# EAGLE design Adafruit GPS Logger Shield Rev D (EAGLE 9.6.2)
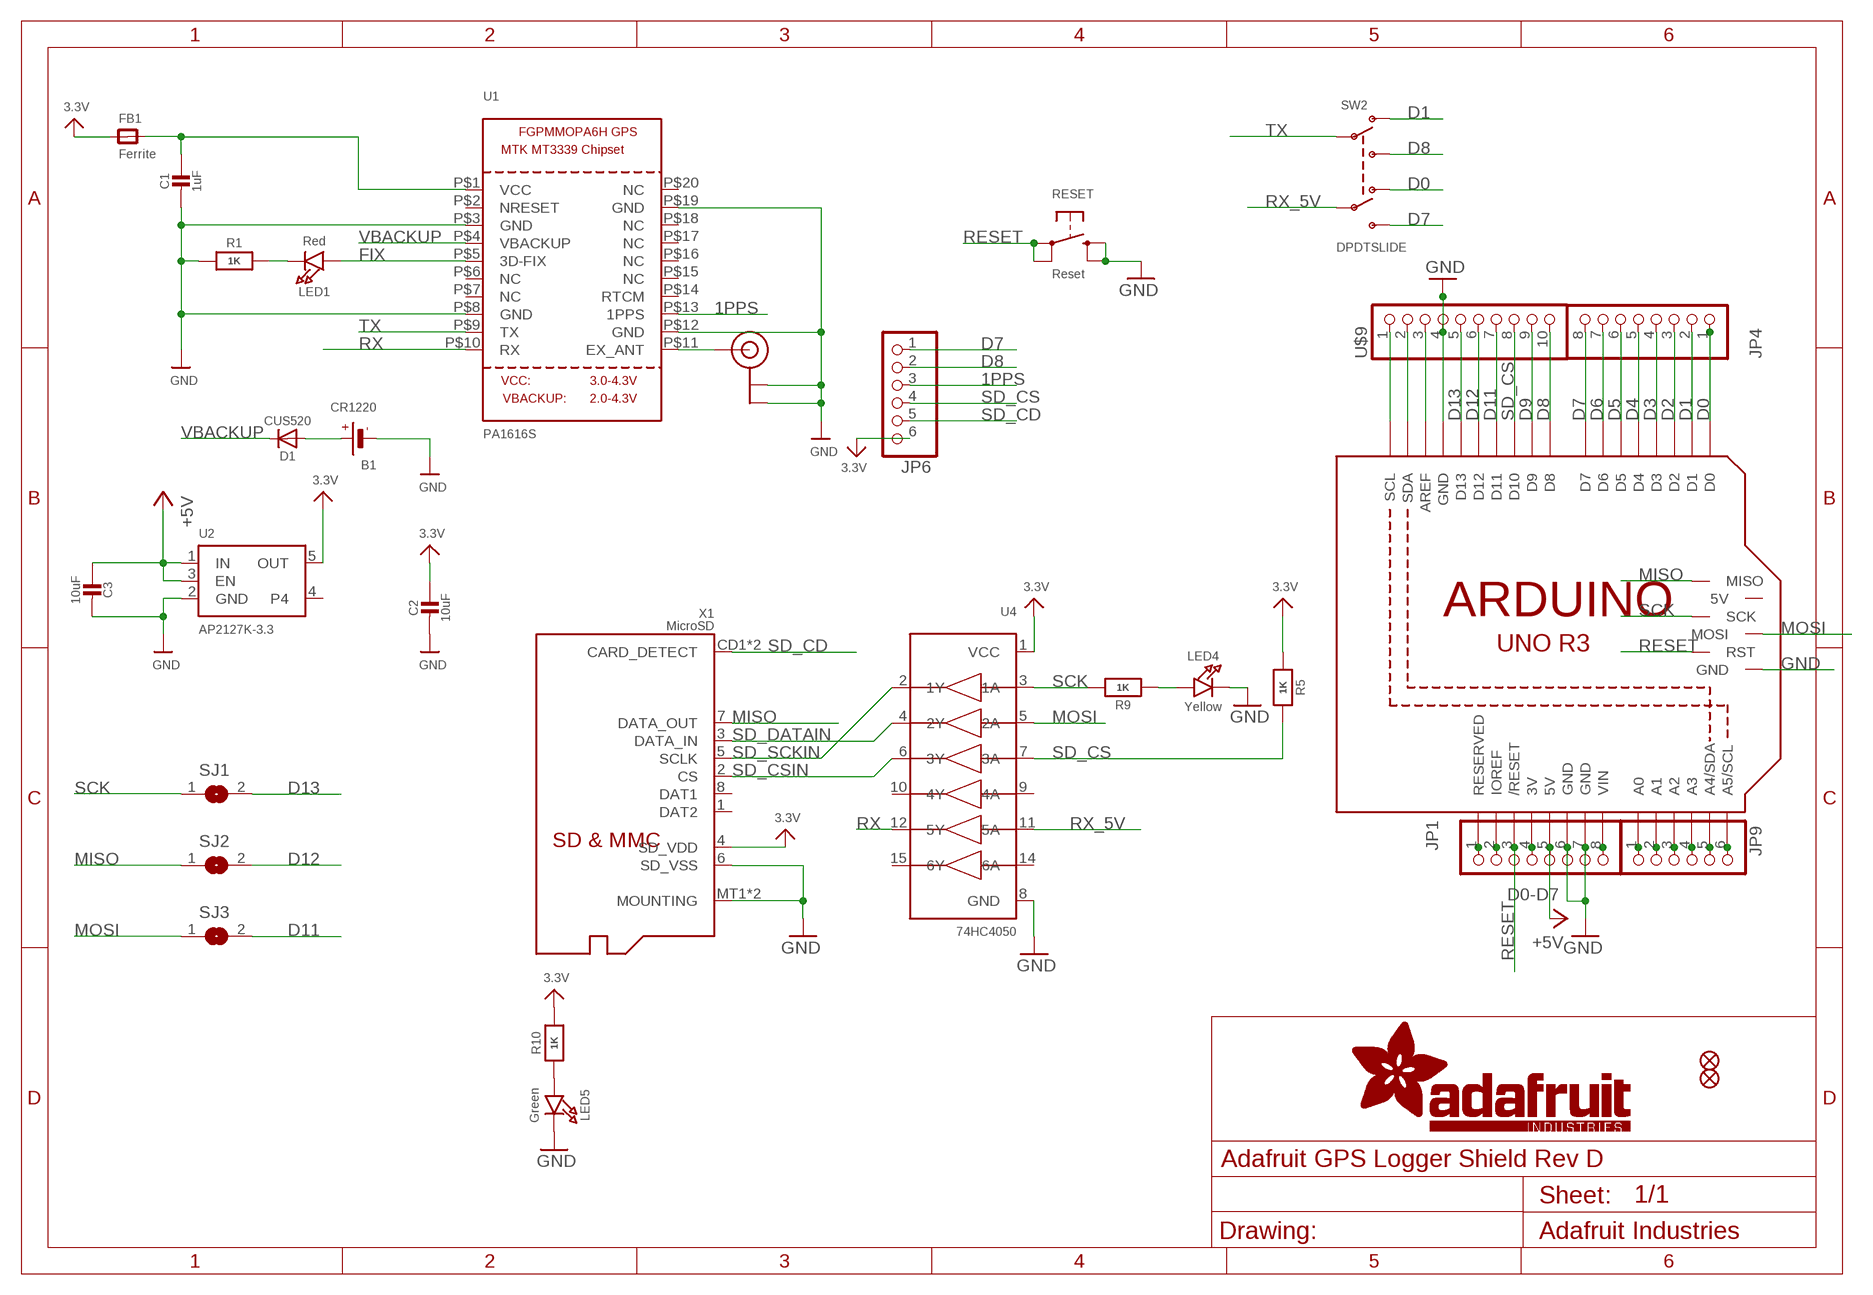
[diagram p0: schematic, sheet 1]

## Parts
B1  CR1220  BATTERYCR1220_SMT  [CR1220]
C1  1uF  CAP_CERAMIC0805-NOOUTLINE  [0805-NO]
C2  10uF  CAP_CERAMIC0805-NOOUTLINE  [0805-NO]
C3  10uF  CAP_CERAMIC0805-NOOUTLINE  [0805-NO]
D1  CUS520  DIODESOD-323  [SOD-323]
FB1  Ferrite  FERRITE0805  [0805]
FID1  FIDUCIAL_1MM  [FIDUCIAL_1MM]
FID2  FIDUCIAL_1MM  [FIDUCIAL_1MM]
JP1  D0-D7  PINHD-1X8BIG  [1X08-BIG]
JP4  PINHD-1X8BIG  [1X08-BIG]
JP6  PINHD-1X6B  [1X06-BIG]
JP9  PINHD-1X6B  [1X06-BIG]
LED1  Red  LED0805_NOOUTLINE  [CHIPLED_0805_NOOUTLINE]
LED4  Yellow  LED0805_NOOUTLINE  [CHIPLED_0805_NOOUTLINE]
LED5  Green  LED0805_NOOUTLINE  [CHIPLED_0805_NOOUTLINE]
M1  ARDUINO_R3_ICSP  [ARDUINOR3_ICSP]
R1  1K  RESISTOR0805_NOOUTLINE  [0805-NO]
R5  1K  RESISTOR0805_NOOUTLINE  [0805-NO]
R9  1K  RESISTOR0805_NOOUTLINE  [0805-NO]
R10  1K  RESISTOR0805_NOOUTLINE  [0805-NO]
RESET  Reset  SWITCH_TACT_SMT_6MM  [6MMX6MM_TACTILE_SMT]
SJ1  SOLDERJUMPER  [SOLDERJUMPER_ARROW_NOPASTE]
SJ2  SOLDERJUMPER  [SOLDERJUMPER_ARROW_NOPASTE]
SJ3  SOLDERJUMPER  [SOLDERJUMPER_ARROW_NOPASTE]
SW2  DPDTSLIDE  SWITCH_DPDTEG1390  [EG1390]
U1  PA1616S  GPS_FGPMMOPA6H  [FGPMMOPA6H]
U2  AP2127K-3.3  VREG_SOT23-5  [SOT23-5]
U4  74HC4050  74HC4050D  [SOIC16]
U$9  PINHD-1X10  [1X10-BIG]
X1  MicroSD  MICROSD  [MICROSD]
X2  u.FL  ANTENNA_U.FL  [U.FL]

## Nets
1PPS: JP6.3 U1.P$13(1PPS)
3.3V: C2.1 FB1.1 JP6.6 R5.1 R10.2 U2.5(OUT) U4.1(VCC) X1.4(SD_VDD)
3V: JP1.4 M1.3V
+5V: C3.1 JP1.5 M1.5V U2.1(IN) U2.3(EN)
A0: JP9.1 M1.A0
A1: JP9.2 M1.A1
A2: JP9.3 M1.A2
A3: JP9.4 M1.A3
A4: JP9.5 M1.A4(A4/SDA)
A5: JP9.6 M1.A5(A5/SCL)
AREF: M1.AREF U$9.3
D0: JP4.1 M1.D0 SW2.O2
D1: JP4.2 M1.D1 SW2.O1
D2: JP4.3 M1.D2
D3: JP4.4 M1.D3
D4: JP4.5 M1.D4
D5: JP4.6 M1.D5
D6: JP4.7 M1.D6
D7: JP4.8 JP6.1 M1.D7 SW2.S2
D8: JP6.2 M1.D8 SW2.S1 U$9.10
D9: M1.D9 U$9.9
D11: M1.D11 SJ3.2 U$9.7
D12: M1.D12 SJ2.2 U$9.6
D13: M1.D13 SJ1.2 U$9.5
FIX: LED1.A U1.P$5(3D-FIX)
GND: B1.- C1.2 C2.2 C3.2 JP1.6 JP1.7 LED4.C LED5.C M1.GND M1.GND@1(GND) M1.GND@2(GND) M1.GND@3(GND) R1.1 RESET.B'(S1) RESET.B(S) U1.P$3(GND) U1.P$8(GND) U1.P$12(GND) U1.P$19(GND) U2.2(GND) U4.8(GND) U$9.4 X1.6(SD_VSS) X1.MT1(MOUNTING) X1.MT2(MOUNTING) X2.1(GND) X2.2(GND)
IOREF: JP1.2 M1.IOREF
MISO: M1.MISO SJ2.1 X1.7(DATA_OUT)
MOSI: M1.MOSI SJ3.1 U4.5(2A)
N$1: C1.1 FB1.2 U1.P$1(VCC)
N$2: LED1.C R1.2
N$3: B1.+$1(+) B1.+$2(+) D1.A
N$4: U1.P$11(EX_ANT) X2.3(SIGNAL)
N$8: LED4.A R9.1
N$150: LED5.A R10.1
NC: JP1.1 M1.RESERVED
RESET: JP1.3 M1.RESET(/RESET) M1.RESET_ICSP(RST) RESET.A'(P1) RESET.A(P)
RX: U1.P$10(RX) U4.12(5Y)
RX_5V: SW2.P2 U4.11(5A)
SCK: M1.SCK R9.2 SJ1.1 U4.3(1A)
SCL: M1.SCL U$9.1
SD_CD: JP6.5 X1.CD1(CARD_DETECT) X1.CD2(CARD_DETECT)
SD_CS: JP6.4 M1.D10 R5.2 U4.7(3A) U$9.8
SD_CSIN: U4.6(3Y) X1.2(CS)
SD_DATAIN: U4.4(2Y) X1.3(DATA_IN)
SD_SCKIN: U4.2(1Y) X1.5(SCLK)
SDA: M1.SDA U$9.2
TX: SW2.P1 U1.P$9(TX)
VBACKUP: D1.C U1.P$4(VBACKUP)
VIN: JP1.8 M1.VIN
Unconnected: M1.5V_ICSP(5V) U1.P$2(NRESET) U1.P$6(NC) U1.P$7(NC) U1.P$14(RTCM) U1.P$15(NC) U1.P$16(NC) U1.P$17(NC) U1.P$18(NC) U1.P$20(NC) U2.4 U4.9(4A) U4.10(4Y) U4.14(6A) U4.15(6Y) X1.1(DAT2) X1.8(DAT1)

## Library data of the parts
B1 = microbuilder:BATTERY: CR1220 SMT - Digikey: 3001K-ND CD2032 BAT-HLD-001 - Digikey: BAT-HLD-001-ND
C1-C3 = microbuilder:CAP_CERAMIC: Ceramic Capacitors For new designs, use the packages preceded by an '_' character since they are more reliable: The following footprints should be used on most boards: _0402 - Standard footprint for regular board layouts _0603 - Standard footprint for regular board layouts _0805 - Standard footprint for regular board layouts _1206 - Standard footprint for regular board layouts For extremely tight-pitch boards where space is at a premium, the following 'micro-pitch' footprints can be used (smaller pads, no silkscreen outline, etc.): _0402MP - Micro-pitch footprint for very dense/compact boards _0603MP - Micro-pitch footprint for very dense/compact boards _0805MP - Micro-pitch footprint for very dense/compact boards _1206MP - Micro-pitch footprint for very dense/compact boards
D1 = microbuilder:DIODE: Diode SMA Model Volts Amps Type Vf Ir Digikey # Notes SSA34-E3 40V 3A Schottky 480mV @ 3A 200uA @ 40V SSA34-E3/61TGITR-ND CDBA120-G 20V 1A Schottky 500mV @ 1A 500uA @ 20V 641-1014-6-ND REEL MBRA210 10V 2A Schottky 350mV @ 2A 700uA @ 10V MBRA210LT3 SOD-123 Model Volts Amps Type Vf Ir Order # Notes BAT54T1G 30V 200mA Schottky 800mV @ 200mA 2uA @ 25V BAT54T1GOSTR-ND B0530W 30V 500mA Schottky 430mV @ 500mA 130uA @ 30V B0530W-FDICT-ND REEL MBR120 20V 1A Schottky 340mV @ 1A MBR120VLSFT1GOSCT-ND SOD-323 Model Volts Amps Type Vf Ir Order # Notes PMEG2005EJ 20V 500mA Schottky 355mV @ 500mA 568-4110-1-ND ZLLS410 10V 570mA Schottky 380mV @ 570mA ZLLS410CT-ND 1N4148WS 75V 150mA Silicon/Simple 1V 1N4148WSFSCT-ND REEL SOD-523 Model Volts Amps Type Vf Ir Order # Notes BAT54XV2 30V 200mA Schottky 0.8V @ 100mA BAT54XV2CT-ND TB751S 30V 30mA Schottky RB751S-40TE61CT-ND SOT23-R/W (R = Solder Paste/Reflow Ovens, W = Hand-Soldering) Model Volts Amps Type Vf Ir Order # Notes BAT54FILM 40V 300mA Schottky 497-7162-1-ND POWERDI-5 Model Volts Amps Type Vf Ir Order # Notes PDS560 60V 5A Schottky 670mV @ 5A 150uA @ 60V PDS560DICT-ND
FB1 = microbuilder:FERRITE: Ferrite Bead 0603 MMZ1608B121C - 120 Ohm @ 100MHz, 600mA, 0.15 Ohm DC Resistance - Digikey: 445-2164-1-ND BK1608HW121-T - 120 Ohm, 600mA Ferrite Chip - Digikey: 587-1876-2-ND 0805 HZ0805B272R-10 - 2.7K Ohm @ 100MHz, 200mA, 0.8 Ohm DC Resistance - Digikey: 240-2504-1-ND (see also Murata BLM21BD272SN1L) MMZ2012Y152B - 1.5K Ohm @ 100MHz, 500mA, 0.4 Ohm DC Resistance - Digikey: 445-1560-1-ND - Mainly for high frequency (80-400MHz) MMZ2012R102A - 1K Ohm @ 100MHz, 500mA, 0.3 Ohm DC Resistance - Digikey: 445-1555-2-ND - More general purpose (10-200MHz)
FID1 FID2 = microbuilder:FIDUCIAL: Fiducial Alignment Points Various fiducial points for machine vision alignment.; BOM: EXCLUDE
JP1 JP4 = adafruit:PINHD-1X8: PIN HEADER
JP6 JP9 = adafruit:PINHD-1X6: PIN HEADER
LED1 LED4 LED5 = microbuilder:LED: LED 0603 - 0603 Surface Mount Package 2mA: Green LED - Low Power (3.9mcd, 2ma, 1.7Vf) - Digikey: 475-2709-2-ND Orange LED - Low Power (9.8mcd, 2ma, 1.8Vf) - Digikey: 475-1194-2-ND Red LED - Low Power (5mcd, 2ma, 1.8Vf) - Digikey: 475-1195-2-ND Yellow LED - Low Power (7mcd, 2ma, 1.8Vf) - Digikey: 475-1196-2-ND 5mA: Blue LED - Low Power (17mcd, 5ma, 2.9Vf) - Digikey: LNJ937W8CRACT-ND 0805 - 0805 Surface Mount Package 2mA: Red LED (8.8mcd, 2mA, 1.8Vf, Clear) - Low Power [Digikey: 475-2510-1-ND] Green LED (5mcd, 2mA, 1.8Vf, Clear) - Low Power [Digikey: 475-2730-1-ND] Yellow LED (11.3mcd, 2mA, 1.8Vf, Clear) - Low Power [Digikey: 475-2555-1-ND] 20mA: Red LED (104mcd, 20mA, Diffused) - LS R976 [Digikey: 475-1278-6-ND] Red LED (12mcd, 20mA, 2.0Vf, Clear) - APT2012EC [Digikey: 754-1128-1-ND] Green LED (15mcd, 20mA, 2.2Vf, Clear) - APT2012GC [Digikey: 754-1131-1-ND] Orange LED (160mcd, 20mA, 2.1Vf, Clear) - APT2012SECK [Digikey: 754-1130-1-ND] 1206 - 1206 Surface Mount Package Green LED (26mcd, 20mA, Diffused) - LG N971 [Digikey: 475-1407-6-ND] Red LED (15mcd, 20mA, Diffused) - LH N974 [Digikey: 475-1416-6-ND] Cree - Cree High-Power Surface Mount LEDs XPEBWT-L1-0000-00D50 - White 111lm 350mA 2.9Vf 6200K 110° XTEAWT-00-0000-00000LEE3 - White 114lm 350mA 2.85Vf 5000K 115° Everlight - Everlight 45-21 Series Surface Mount LEDs 45-21/QK2C-B2832AC2CB2/2T - Warm White 2000mcd 20mA 3.25Vf 3050K 120° 45-21/LK2C-B38452C4CB2/2T - Nuetral White 2000mcd 20mA 3.25Vf 4150K 120° 45-21/LK2C-B50634C6CB2/2T - Cold White 2200mcd 20mA 3.25Vf 5650K 120° PLCC2 Reverse Mount LS T77K-J1L2-1-0-2-R18-Z - Red 11.25mcd 2mA 1.8Vf 630nm 120° LO T77K-L1M2-24-Z - Orange 19.6mcd 2mA 1.8Vf 606nm 120° LY T77K-K2M1-26-Z - Yellow 15.7mcd 2mA 1.8Vf 587nm 120°; ROT: 270
M1 = adafruit_micro:ARDUINO_R3_ICSP
R1 R5 R9 R10 = microbuilder:RESISTOR: Resistors For new designs, use the packages preceded by an '_' character since they are more reliable: The following footprints should be used on most boards: _0402 - Standard footprint for regular board layouts _0603 - Standard footprint for regular board layouts _0805 - Standard footprint for regular board layouts _1206 - Standard footprint for regular board layouts For extremely tight-pitch boards where space is at a premium, the following 'micro-pitch' footprints can be used (smaller pads, no silkscreen outline, etc.): _0402MP - Micro-pitch footprint for very dense/compact boards _0603MP - Micro-pitch footprint for very dense/compact boards _0805MP - Micro-pitch footprint for very dense/compact boards _1206MP - Micro-pitch footprint for very dense/compact boards
RESET = adafruit_electromech:SWITCH_TACT_SMT: SMT Tact Switches RKB2 https://www.digikey.com/short/m027prz5
SJ1-SJ3 = microbuilder:SOLDERJUMPER: SMD Solder JUMPER Solder the two pads together to create a connection, or remove the solder to break it. REFLOW - Use this footprint for solder paste and reflow ovens. WAVE - Use this footprint for hand-soldering (larger pads). CLOSED - Has a trace between the two pads to ensure it is closed by default. The trace needs to be cut to disable the jumper, and can be closed again by creating a solder bridge between the two pads.; BOM: EXCLUDE
SW2 = adafruit_electromech:SWITCH_DPDT: Switch - DPDT A DPDT Switch acts like an SPDT switch, but has a pair of switches instead of just one. Vertical - 0.3A @ 6V SMT - Digikey: JS202011SCQN; LCSC: C2837066
U1 = microbuilder:GPS_FGPMMOPA6H: GPS Module - MTK MT3339 Chipset, -165dBm sensitivity, 22 channels, 10Hz, auto-select external antenna options
U2 = adafruit_power:VREG_SOT23-5: SOT23-5 Fixed Voltage Regulators Part Current Out V Out V In V Dropout θJA (°C/W) TJ (°C) Digikey Part No. ADP121 150mA 3.3V 3.4-5.5V 0.09V @ 150mA -- -- ADP121-AUJZ33R7CT-ND ADP121 150mA 3.0V 3.1-5.5V 0.09V @ 150mA -- -- ADP121-AUJZ30R7CT-ND ADP122 300mA 3.3V 3.4-5.5V 0.085V @ 300mA -- -- ADP122AUJZ-3.3-R7CT-ND ADP1712 300mA 3.3V 3.5-5.5V 0.17V @ 300mA -- -- ADP1712AUJZ-3.3-R7TR-ND AP7311 (Low Cost) 150mA 3.3V 3.5-6V 0.15V @ 150mA -- -- AP7311-33WG-7DICT-ND LD39015M18R 150mA 1.8V 1.9V-5.5V 0.08V @ 100mA -- -- 497-6977-1-ND LP2985A-33DBVR 150mA 3.3V 3.3-16V 0.28V @ 150mA 206 150 296-18479-1-ND MCP1824T-3302E/OT 300mA 3.3V 3.5V-6V 0.2V @ 300mA -- -- MCP1824T-3302E/OTCT-ND MIC5205-2.5YM5 TR 150mA 2.5V 2.7-16V 0.165V @ 150mA -- -- 576-1257-2-ND MIC5205-3.0YM5 TR 150mA 3.0V 3.2V-16V 0.165V @ 150mA -- -- 576-1258-2-ND MIC5205-3.3YM5 TR 150mA 3.3V 3.5V-16V 0.165V @ 150mA -- -- 576-1259-2-ND TPS780330220 150mA 3.3V+2.2V 3.6-5.5V 250mV Max -- -- 296-23332-1-ND TDA3663/N1,135 100mA 3.3V 3.5-45V 0.18V @ 50mA -- -- 568-5343-1-ND Max operating temp can be calculated using θJA, TJ (max junction temperature), and power in watts. Set the "Maximum Ambient Temperature" until it reaches TJ ("Max Junction Temperature"), which is the absolute limit for safe use of the regulator: Heat Sink Temperature Calculator <http://www.daycounter.com/Calculators/Heat-Sink-Temperature-Calculator.phtml> For example, With 12V source into a 3.3V LP2985 and a 30mA load, we are dissipating (12V-3.3V) * 0.03A = 0.261W. With a θJA of 206 °C/W, a TJ of 150°C, and 261mW we can safely use the chip without a heat sink up to 75°C (=147.1°C Junction Temperature).; JLC_ROTATION: 270
U4 = microbuilder:74HC4050D: 6-channel level shifter 74HC4050D - 2V-6V Supply SOIC16 Digikey: 74HC4050D,653-ND Mouser: 771-74HC4050D-T TSSOP16 Digikey: 296-9215-1-ND Mouser:
U$9 = adafruit:PINHD-1X10: Pin header 1x10 0.1" spacing With round pins
X1 = adafruit_electromech:MICROSD: MicroSD/Transflash Card Holder with SPI pinout 3M: 2908-05WB-MG 4UConnector: 19656 Footprint courtesy: Adafruit Industries; JLC_ROTATION: 90; LCSC: C125617
X2 = adafruit_wireless:ANTENNA_U.FL: U.FL Antenna Connector

## Board
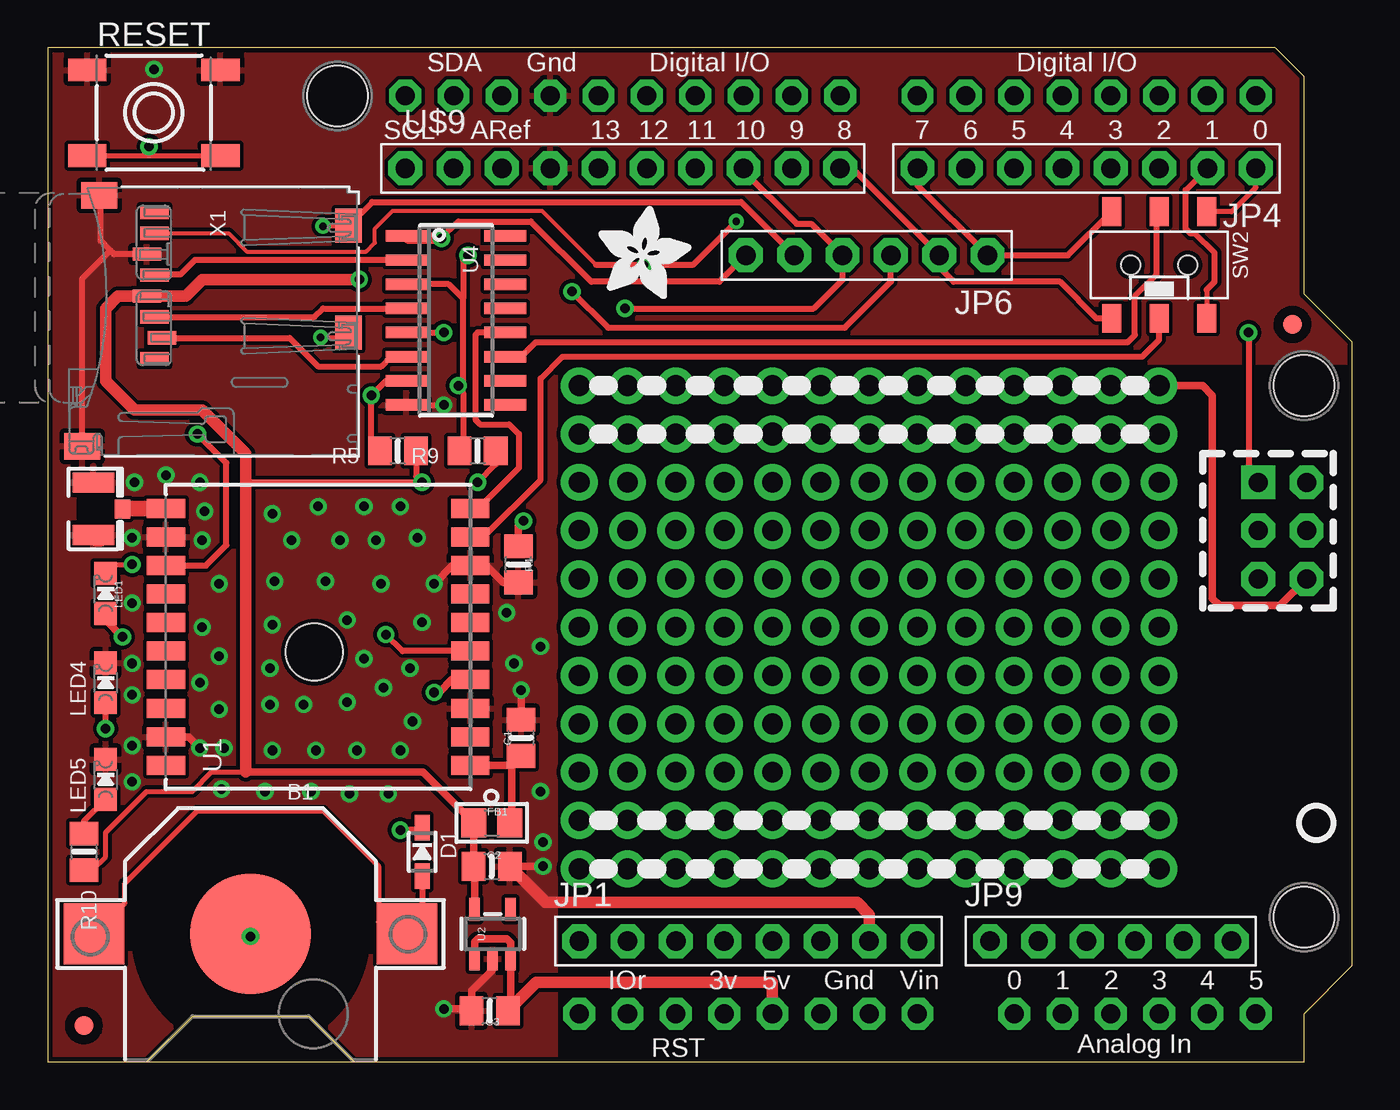
[diagram p1: board, top side]
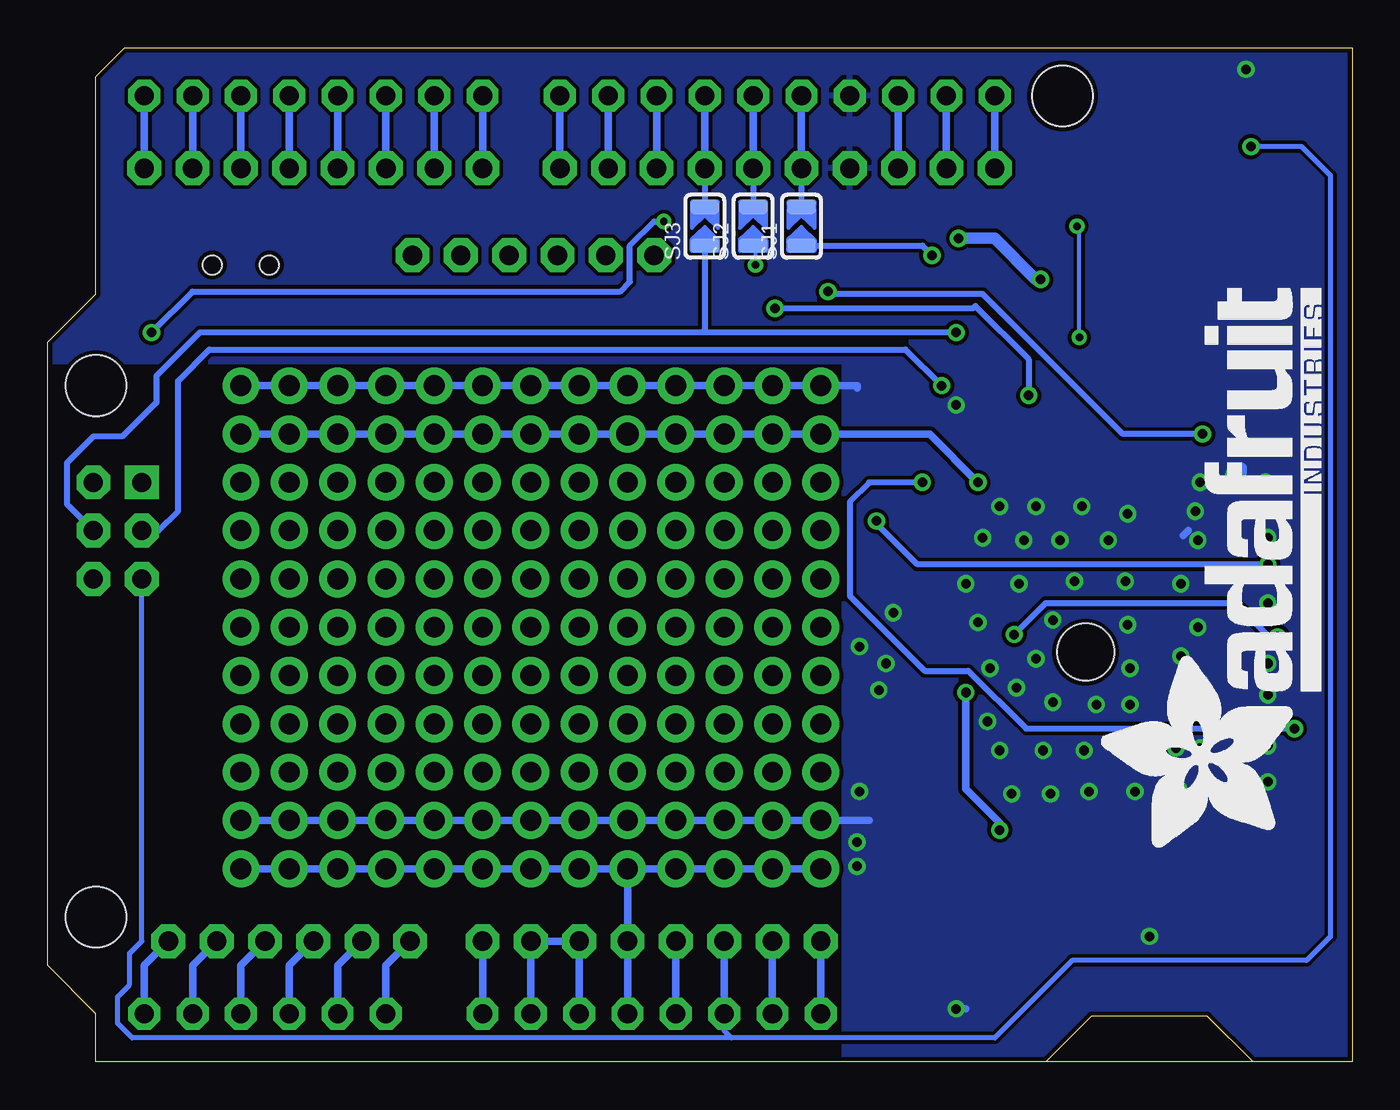
[diagram p2: board, bottom side, seen from below]

Size 68.58 x 53.34 mm. Coordinates in mm from the lower left corner, seen from the top.
Outline: 0,0 5.21,0 7.62,2.41 13.72,2.41 16.13,0 66.04,0 66.04,2.54 68.58,5.08 68.58,37.85 66.04,40.39 66.04,51.82 64.52,53.34 0,53.34 0,0
Copper layers (1*16): Top 0.035mm / dielectric 1.5mm / Bottom 0.035mm
Design rules "adafruit *": minimum track width 8mil, minimum drill 15.5mil, track to track 8mil, track to pad 8mil, pad to pad 8mil, via to via 8mil, smd to smd 8mil, copper to edge 10mil, drill to drill 8mil, minimum pad ring 10mil, minimum via ring 8mil, stop-mask expansion 2mil, vias tented up to drill 20mil, thermal gap 10mil
Holes 3.2 mm at 15.24,50.8 66.04,35.56 66.04,7.62

### Footprints (pad centres in the part's own frame; a part is rotated, then mirrored left to right if it is on the bottom)
CR1220 = smd 3.2 x 3.2: +$1 -8.225,0; +$2 8.225,0 | smd 6.35 x 6.35: - 0,0
0805-NO = smd 1.24 x 1.5: 1 -0.95,0; 2 0.95,0
SOD-323 = smd 1.35 x 0.8: A 1.27,0; C -1.27,0
0805 = smd 1.3 x 1.5: 1 -0.95,0; 2 0.95,0
FIDUCIAL_1MM = smd 1 x 1: 1 0,0
1X08-BIG = drill 1.016 pad 1.778 octagon: 1 -8.89,0; 2 -6.35,0; 3 -3.81,0; 4 -1.27,0; 5 1.27,0; 6 3.81,0; 7 6.35,0; 8 8.89,0
1X06-BIG = drill 1.016 pad 1.778 octagon: 1 -6.35,0; 2 -3.81,0; 3 -1.27,0; 4 1.27,0; 5 3.81,0; 6 6.35,0
CHIPLED_0805_NOOUTLINE = smd 1.2 x 1.2: A 0,-1.05; C 0,1.05
ARDUINOR3_ICSP = drill 1 pad 1.676 octagon: 3V 35.56,2.54; 5V 38.1,2.54; A0 50.8,2.54; A1 53.34,2.54; A2 55.88,2.54; A3 58.42,2.54; A4 60.96,2.54; A5 63.5,2.54; AREF 23.876,50.8; D0 63.5,50.8; D1 60.96,50.8; D2 58.42,50.8; D3 55.88,50.8; D4 53.34,50.8; D5 50.8,50.8; D6 48.26,50.8; D7 45.72,50.8; D8 41.656,50.8; D9 39.116,50.8; D10 36.576,50.8; D11 34.036,50.8; D12 31.496,50.8; D13 28.956,50.8; GND 26.416,50.8; GND@1 43.18,2.54; GND@2 40.64,2.54; IOREF 30.48,2.54; RESERVED 27.94,2.54; RESET 33.02,2.54; SCL 18.796,50.8; SDA 21.336,50.8; VIN 45.72,2.54 | drill 1 pad 1.778 octagon: 5V_ICSP 66.167,30.48; GND@3 66.167,25.4; MOSI 66.167,27.94; RESET_ICSP 63.627,25.4; SCK 63.627,27.94 | drill 1 pad 1.778 square: MISO 63.627,30.48
6MMX6MM_TACTILE_SMT = smd 2 x 1.2: A -3.5,-2.25; A' 3.5,-2.25; B -3.5,2.25; B' 3.5,2.25
SOLDERJUMPER_ARROW_NOPASTE = smd 0.762 x 1.524: 1 -1.016,0; 2 1.016,0
EG1390 = smd 1 x 1.5: O1 -2.5,2.8; O2 -2.5,-2.8; P1 0,2.8; P2 0,-2.8; S1 2.5,2.8; S2 2.5,-2.8 | hole 1: 1.5,0; -1.5,0
FGPMMOPA6H = smd 2 x 1: P$1 -8,6.75; P$2 -8,5.25; P$3 -8,3.75; P$4 -8,2.25; P$5 -8,0.75; P$6 -8,-0.75; P$7 -8,-2.25; P$8 -8,-3.75; P$9 -8,-5.25; P$10 -8,-6.75; P$11 8,-6.75; P$12 8,-5.25; P$13 8,-3.75; P$14 8,-2.25; P$15 8,-0.75; P$16 8,0.75; P$17 8,2.25; P$18 8,3.75; P$19 8,5.25; P$20 8,6.75 | hole 3: 0.2,0.8
SOT23-5 = smd 0.55 x 1.2: 1 -0.95,-1.3; 2 0,-1.3; 3 0.95,-1.3; 4 0.95,1.3; 5 -0.95,1.3
SOIC16 = smd 0.6 x 2.2: 1 -4.445,-2.6; 2 -3.175,-2.6; 3 -1.905,-2.6; 4 -0.635,-2.6; 5 0.635,-2.6; 6 1.905,-2.6; 7 3.175,-2.6; 8 4.445,-2.6; 9 4.445,2.6; 10 3.175,2.6; 11 1.905,2.6; 12 0.635,2.6; 13 -0.635,2.6; 14 -1.905,2.6; 15 -3.175,2.6; 16 -4.445,2.6
1X10-BIG = drill 1.016 pad 1.778 octagon: 1 -11.43,0; 2 -8.89,0; 3 -6.35,0; 4 -3.81,0; 5 -1.27,0; 6 1.27,0; 7 3.81,0; 8 6.35,0; 9 8.89,0; 10 11.43,0
MICROSD = smd 0.7 x 1.5: 1 1.761,-3.147; 2 0.661,-2.747; 3 -0.439,-3.147; 4 -1.539,-3.547; 5 -2.639,-3.147; 6 -3.739,-3.547; 7 -4.839,-3.147; 8 -5.939,-3.147 | smd 1.8 x 1.4: CD1 -5.239,7.053; CD2 0.38,7.053 | smd 1.4 x 1.9: MT1 -6.839,-6.047; MT2 6.361,-6.947
U.FL = smd 1.05 x 2.2: 1 1.375,0.762; 2 -1.375,0.762 | smd 1 x 0.8: 3 0,-0.763

### Placement (x,y rotation side)
B1  10.67,6.73 180 top
C1  24.89,17.04 90 top
C2  23.34,10.29 0 top
C3  23.24,2.69 180 top
D1  19.68,11.05 270 top
FB1  23.34,12.57 0 top
FID1  1.91,1.91 0 top
FID2  65.43,38.78 0 top
JP1  36.83,6.35 0 top
JP4  54.61,46.99 180 top
JP6  43.05,42.42 180 top
JP9  55.88,6.35 0 top
LED1  3.05,24.64 0 top
LED4  3.05,19.94 0 top
LED5  3.05,14.86 0 top
M1  0,0 0 top
PLABEL0  [PLABEL0]  1.65,23.24 90 top
PLABEL1  [PLABEL1]  1.65,12.83 90 top
PLABEL2  [PLABEL2]  1.65,18.29 90 top
PLABEL3  [PLABEL3]  11.81,46.99 90 top
PLABEL4  [PLABEL4]  63.75,39.62 90 top
PLABEL5  [PLABEL5]  52.7,40.13 90 top
PLABEL6  [PLABEL6]  54.48,39.62 90 top
PLABEL7  [PLABEL7]  47.37,38.99 90 top
PLABEL8  [PLABEL8]  49.91,38.86 90 top
PLABEL9  [PLABEL9]  44.83,38.1 90 top
PLABEL10  [PLABEL10]  42.29,37.85 90 top
PLABEL11  [PLABEL11]  39.75,38.86 90 top
PLABEL12  [PLABEL12]  37.21,39.12 90 top
PLABEL13  [PLABEL13]  35.69,44.58 0 top
PLABEL14  [PLABEL14]  44.83,44.58 0 top
PLABEL15  [PLABEL15]  40.77,44.58 0 top
PLABEL16  [PLABEL16]  60.45,13.46 0 top
PLABEL17  [PLABEL17]  62.36,26.29 90 top
PLABEL18  [PLABEL18]  59.69,35.05 0 top
PLABEL19  [PLABEL19]  59.69,32.51 0 top
PLABEL20  [PLABEL20]  59.69,12.19 0 top
PLABEL21  [PLABEL21]  59.69,9.65 0 top
PLABEL22  [PLABEL22]  29.46,42.16 90 bottom
PLABEL23  [PLABEL23]  32,42.16 90 bottom
PLABEL24  [PLABEL24]  34.54,42.16 90 bottom
R1  24.74,26.16 90 top
R5  18.41,32.13 180 top
R9  22.61,32.13 180 top
R10  1.91,11.05 270 top
RESET  5.59,49.91 0 top
SJ1  28.96,43.94 90 bottom
SJ2  31.5,43.94 90 bottom
SJ3  34.04,43.94 90 bottom
SW2  58.42,41.91 180 top
U1  14.22,22.35 180 top
U2  23.39,6.73 0 top
U4  21.46,38.99 270 top
U$9  30.23,46.99 0 top
U$13  [ADAFRUIT_5MM]  28.96,40.13 0 top
U$15  [ADAFRUIT_TEXT_30MM]  1.65,11.05 90 bottom
U$16  [PCBFEAT-REV-040]  66.67,12.57 0 top
X1  8.76,38.73 270 top
X2  3.17,29.08 90 top

### Tracks (layer width: path | path; a pad name or v marks a point on that pad's centre or on a via)
1PPS  (via drill 0.5)
  Top 0.305: U1.P$13 8.32,26.1 9.4,27.18 9.4,31.5 v7.87,33.02 | v27.56,40.51 29.46,38.61 41.91,38.61 44.32,41.02 JP6.3
  Bottom 0.305: v7.87,33.02 12.06,33.02 19.43,40.39 27.43,40.39 v27.56,40.51
3.3V  (via drill 0.5, 1.1 pad 1.93, 1.2 pad 1.93)
  Top 0.254: R10.2 2.35,10.1 3.05,10.79 3.05,12.06 5.21,14.22 7.62,14.22 8.64,15.24 10.29,15.24 10.41,15.37
  Top 0.305: v20.7,43.31 21.59,44.2 25.4,44.2 28.57,41.02 35.31,41.02 JP6.6 | R5.1 19.36,30.8 v19.68,30.48 | 19.3,30.48 10.41,30.48
  Top 0.406: 10.41,15.24 19.73,15.24 FB1.1 C2.1 22.44,10.24 U2.5 | v19.68,30.48 19.3,30.48
  Top 0.61: 10.41,15.24 10.41,15.37 10.41,30.48 10.41,32 8.13,34.29 4.57,34.29 3.05,35.81 3.05,39.62 3.7,40.27 X1.4 7.25,40.27 8.13,41.15 v16.38,41.15 | v20.7,43.31 18.99,43.31 U4.1
  Bottom 0.406: v58.42,33.02 v55.88,33.02 v53.34,33.02 v50.8,33.02 v48.26,33.02 v45.72,33.02 v43.18,33.02 v40.64,33.02 v38.1,33.02 v35.56,33.02 v33.02,33.02 v30.48,33.02 v27.94,33.02 22.23,33.02 v19.68,30.48
  Bottom 0.61: v20.7,43.31 18.8,43.31 16.64,41.15 v16.38,41.15
3V
  Bottom 0.406: JP1.4 M1.3V | M1.3V 35.56,2.29 35.81,2.03 35.81,2.29 M1.3V
+5V  (via drill 1.1 pad 1.93)
  Top 0.406: U2.1 22.44,6.31 22.61,6.48 24.13,6.48 24.34,6.26 U2.3 24.34,2.84 C3.1
  Top 0.61: C3.1 25.69,4.19 38.1,4.19 M1.5V
  Bottom 0.406: M1.5V JP1.5 v38.1,10.16 | v27.94,10.16 v30.48,10.16 v33.02,10.16 v35.56,10.16 v38.1,10.16 | v38.1,10.16 v40.64,10.16 v43.18,10.16 v45.72,10.16 v48.26,10.16 v50.8,10.16 v53.34,10.16 v55.88,10.16 v58.42,10.16
A0
  Bottom 0.406: M1.A0 50.8,5.08 JP9.1
A1
  Bottom 0.406: M1.A1 53.34,5.08 JP9.2
A2
  Bottom 0.406: M1.A2 55.88,5.08 JP9.3
A3
  Bottom 0.406: M1.A3 58.42,5.08 JP9.4
A4
  Bottom 0.406: M1.A4 60.96,5.08 JP9.5
A5
  Bottom 0.406: M1.A5 63.5,5.08 JP9.6
AREF
  Bottom 0.406: M1.AREF U$9.3
D0
  Top 0.254: JP4.1 63.5,45.97 62.24,44.71 SW2.O2
  Bottom 0.406: M1.D0 JP4.1
D1
  Top 0.254: 60.92,40.6 SW2.O1
  Top 0.305: 60.92,40.6 61.34,41.02 61.34,42.55 60.33,43.56 60.07,43.56 59.82,43.81 59.82,45.85 JP4.2
  Bottom 0.406: JP4.2 M1.D1
D2
  Bottom 0.406: JP4.3 M1.D2
D3
  Bottom 0.406: M1.D3 JP4.4
D4
  Bottom 0.406: M1.D4 JP4.5
D5
  Bottom 0.406: M1.D5 JP4.6
D6
  Bottom 0.406: M1.D6 JP4.7
D7
  Top 0.305: JP4.8 45.72,46.1 JP6.1 53.63,42.42 SW2.S2
  Bottom 0.406: M1.D7 JP4.8
D8
  Top 0.305: SW2.S1 55.12,39.11 53.21,41.02 47.62,41.02 46.86,41.78 JP6.2 42.29,46.99 U$9.10
  Bottom 0.406: M1.D8 U$9.10
D9
  Bottom 0.406: M1.D9 U$9.9
D11
  Bottom 0.305: U$9.7 SJ3.2
  Bottom 0.406: M1.D11 U$9.7
D12
  Bottom 0.305: U$9.6 SJ2.2
  Bottom 0.406: M1.D12 U$9.6
D13
  Bottom 0.305: U$9.5 SJ1.2
  Bottom 0.406: M1.D13 U$9.5
FIX  (via drill 0.5)
  Top 0.305: U1.P$5 18.66,21.6 v17.78,22.48 | 3.05,23.21 LED1.A
  Top 0.406: 3.05,23.21 3.08,23.21 v3.94,22.35
  Bottom 0.305: v17.78,22.48 16.13,24.13 6.14,24.13 4.36,22.35 v3.94,22.35
GND  (via drill 0.5, 1.1 pad 1.93)
  Top 0.305: X1.6 3.5,42.47 3.3,42.67 | 3.3,42.67 2.79,43.18 2.79,45.5 X1.MT1 | X1.MT2 1.82,41.19 3.3,42.67 | U4.8 v20.83,34.54
  Top 0.406: U2.2 23.37,5.41 23.37,4.83 22.29,3.75 C3.2 22.19,2.79 v20.83,2.79 | C2.2 v26.04,10.29 | B1.- v10.67,6.6 | R1.1 23.94,25.21 23.05,26.1 U1.P$8 21.28,26.1 v20.32,25.15 | C1.2 v24.89,19.56 | U1.P$19 7.41,17.1 v8,16.51 | M1.GND@3 64.77,24 61.59,24 61.21,24.38 61.21,35.05 60.71,35.56 v58.42,35.56
  Top 0.61: JP1.7 43.18,7.75 42.55,8.38 26.16,8.38 26.16,8.42 C2.2
  Top 0.813: X2.2 2.62,27.5 | 2.87,27.6 2.77,27.5
  Bottom 0.305: v20.83,34.54 21.08,34.54 | v20.32,25.15 20.19,25.15
  Bottom 0.406: v20.83,2.79 20.32,2.79 | 8.64,27.94 8.89,27.69 | v58.42,35.56 v55.88,35.56 v53.34,35.56 v50.8,35.56 v48.26,35.56 v45.72,35.56 v43.18,35.56 v40.64,35.56 v38.1,35.56 v35.56,35.56 v33.02,35.56 v30.48,35.56 v27.94,35.56 26.04,35.56 26.04,35.43 | v58.42,12.7 v55.88,12.7 v53.34,12.7 v50.8,12.7 v48.26,12.7 v45.72,12.7 v43.18,12.7 v40.64,12.7 v38.1,12.7 v35.56,12.7 v33.02,12.7 v30.48,12.7 v27.94,12.7 25.4,12.7 | M1.GND@1 JP1.7 JP1.6 M1.GND@2
  Bottom 0.61: 5.84,30.99 5.84,31.24
  other vias: 5.59,52.2 4.57,30.48 8.13,27.43 8,30.48 11.94,25.27 14.61,25.27 17.53,25.15 19.43,27.56 17.27,27.43 15.37,27.43 12.83,27.43 11.81,28.83 14.22,29.21 16.64,29.21 18.54,29.21 19.68,23.11 16.64,21.21 9.02,25.15 8.13,22.86 19.05,20.7 9.02,21.34 8,19.94 9.02,18.54 9.27,16.51 11.68,18.8 13.46,18.8 15.75,18.92 11.81,22.99 11.68,20.7 15.75,23.24 17.65,19.68 11.81,16.38 14.1,16.38 16.26,16.38 18.54,16.38 19.18,17.91 17.91,14.1 15.88,14.1 13.84,14.22 11.43,14.22 9.14,14.35 4.45,27.56 6.22,30.86 8.26,28.96 24.13,23.62 25.91,21.84 24.51,20.95 25.91,14.22 26.04,11.56 4.45,20.95 4.45,19.3 4.45,16.64 4.45,14.73 4.45,24.13
  pour Top: 0,0 26.67,0 26.67,36.83 68.58,36.83 68.58,37.85 66.04,40.39 66.04,51.82 64.52,53.34 0,53.34
  pour Bottom: 0,0 26.67,0 26.67,36.83 68.58,36.83 68.58,37.85 66.04,40.39 66.04,51.82 64.52,53.34 0,53.34
IOREF
  Bottom 0.406: M1.IOREF JP1.2
MISO  (via drill 0.39, 0.5)
  Top 0.203: X1.7 9.51,43.57 10.46,42.62 16.75,42.62 17.2,43.08 17.2,43.82 18.13,44.76 25.98,44.76 28.83,41.91 | v31.37,41.91 v31.37,41.9
  Top 0.305: v63.12,38.35 63.12,30.99 M1.MISO | v36.2,44.2 33.91,41.91 v31.37,41.91 28.83,41.91
  Bottom 0.203: v31.37,41.9 31.37,42.8 SJ2.1
  Bottom 0.305: v63.12,38.35 60.96,40.51 38.48,40.51 37.97,41.02 37.97,42.93 36.7,44.2 v36.2,44.2
MOSI  (via drill 0.5)
  Top 0.305: U4.5 v20.83,38.35
  Bottom 0.305: v20.83,38.35 34.16,38.35 | 34.16,38.35 60.58,38.35 62.87,36.07 62.87,34.67 64.64,32.89 66.17,32.89 67.56,31.5 67.56,29.34 M1.MOSI | SJ3.1 34.04,38.48 34.16,38.35
N$1
  Top 0.406: U1.P$1 24.4,15.6 | 24.4,15.6 C1.1 | 24.4,15.6 24.4,12.68 FB1.2
N$2  (via drill 0.5)
  Top 0.254: LED1.C 3.52,26.16 v4.45,26.16
  Top 0.406: R1.2 24.74,28.17 v25.02,28.45
  Bottom 0.305: v4.45,26.16 22.86,26.16 25.02,28.32 v25.02,28.45
N$3
  Top 0.254: B1.+$2 4.06,8.35 4.06,9.4 7.87,13.21 14.48,13.21 17.4,10.29 17.4,7.37 18.03,6.73 B1.+$1
  Top 0.305: D1.A 19.68,7.52 B1.+$1
N$4
  Top 0.813: U1.P$11 3.92,29.1 X2.3
N$8  (via drill 0.5)
  Top 0.305: v3.05,17.53 LED4.A | R9.1 23.56,31.43 v22.61,30.48
  Bottom 0.305: v22.61,30.48 25.4,30.48 26.42,29.46 26.42,24.51 22.48,20.57 20.19,20.57 17.14,17.53 v3.05,17.53
N$21  (via drill 1.1 pad 1.93)
  other vias: 33.02,30.48
N$22  (via drill 1.1 pad 1.93)
  other vias: 33.02,27.94
N$24  (via drill 1.1 pad 1.93)
  other vias: 50.8,30.48
N$25  (via drill 1.1 pad 1.93)
  other vias: 48.26,30.48
N$26  (via drill 1.1 pad 1.93)
  other vias: 45.72,30.48
N$27  (via drill 1.1 pad 1.93)
  other vias: 43.18,30.48
N$28  (via drill 1.1 pad 1.93)
  other vias: 40.64,30.48
N$29  (via drill 1.1 pad 1.93)
  other vias: 38.1,30.48
N$30  (via drill 1.1 pad 1.93)
  other vias: 35.56,30.48
N$31  (via drill 1.1 pad 1.93)
  other vias: 50.8,27.94
N$32  (via drill 1.1 pad 1.93)
  other vias: 38.1,27.94
N$33  (via drill 1.1 pad 1.93)
  other vias: 40.64,27.94
N$34  (via drill 1.1 pad 1.93)
  other vias: 43.18,27.94
N$35  (via drill 1.1 pad 1.93)
  other vias: 45.72,27.94
N$36  (via drill 1.1 pad 1.93)
  other vias: 48.26,27.94
N$38  (via drill 1.1 pad 1.93)
  other vias: 50.8,25.4
N$39  (via drill 1.1 pad 1.93)
  other vias: 50.8,22.86
N$40  (via drill 1.1 pad 1.93)
  other vias: 50.8,20.32
N$42  (via drill 1.1 pad 1.93)
  other vias: 35.56,25.4
N$43  (via drill 1.1 pad 1.93)
  other vias: 38.1,25.4
N$44  (via drill 1.1 pad 1.93)
  other vias: 40.64,25.4
N$45  (via drill 1.1 pad 1.93)
  other vias: 43.18,25.4
N$46  (via drill 1.1 pad 1.93)
  other vias: 45.72,25.4
N$47  (via drill 1.1 pad 1.93)
  other vias: 48.26,25.4
N$48  (via drill 1.1 pad 1.93)
  other vias: 53.34,25.4
N$50  (via drill 1.1 pad 1.93)
  other vias: 53.34,20.32
N$52  (via drill 1.1 pad 1.93)
  other vias: 53.34,27.94
N$55  (via drill 1.1 pad 1.93)
  other vias: 53.34,22.86
N$56  (via drill 1.1 pad 1.93)
  other vias: 48.26,22.86
N$57  (via drill 1.1 pad 1.93)
  other vias: 45.72,22.86
N$58  (via drill 1.1 pad 1.93)
  other vias: 43.18,22.86
N$59  (via drill 1.1 pad 1.93)
  other vias: 40.64,22.86
N$60  (via drill 1.1 pad 1.93)
  other vias: 38.1,22.86
N$61  (via drill 1.1 pad 1.93)
  other vias: 35.56,22.86
N$62  (via drill 1.1 pad 1.93)
  other vias: 33.02,25.4
N$64  (via drill 1.1 pad 1.93)
  other vias: 50.8,15.24
N$65  (via drill 1.1 pad 1.93)
  other vias: 53.34,17.78
N$66  (via drill 1.1 pad 1.93)
  other vias: 35.56,20.32
N$67  (via drill 1.1 pad 1.93)
  other vias: 38.1,20.32
N$68  (via drill 1.1 pad 1.93)
  other vias: 40.64,20.32
N$69  (via drill 1.1 pad 1.93)
  other vias: 43.18,20.32
N$70  (via drill 1.1 pad 1.93)
  other vias: 45.72,20.32
N$71  (via drill 1.1 pad 1.93)
  other vias: 48.26,20.32
N$78  (via drill 1.1 pad 1.93)
  other vias: 35.56,17.78
N$79  (via drill 1.1 pad 1.93)
  other vias: 38.1,17.78
N$80  (via drill 1.1 pad 1.93)
  other vias: 40.64,17.78
N$81  (via drill 1.1 pad 1.93)
  other vias: 43.18,17.78
N$82  (via drill 1.1 pad 1.93)
  other vias: 45.72,17.78
N$83  (via drill 1.1 pad 1.93)
  other vias: 48.26,17.78
N$84  (via drill 1.1 pad 1.93)
  other vias: 50.8,17.78
N$87  (via drill 1.1 pad 1.93)
  other vias: 58.42,30.48
N$88  (via drill 1.1 pad 1.93)
  other vias: 55.88,27.94
N$91  (via drill 1.1 pad 1.93)
  other vias: 53.34,15.24
N$92  (via drill 1.1 pad 1.93)
  other vias: 48.26,15.24
N$93  (via drill 1.1 pad 1.93)
  other vias: 45.72,15.24
N$94  (via drill 1.1 pad 1.93)
  other vias: 43.18,15.24
N$95  (via drill 1.1 pad 1.93)
  other vias: 40.64,15.24
N$96  (via drill 1.1 pad 1.93)
  other vias: 38.1,15.24
N$97  (via drill 1.1 pad 1.93)
  other vias: 35.56,15.24
N$101  (via drill 1.1 pad 1.93)
  other vias: 58.42,27.94
N$111  (via drill 1.1 pad 1.93)
  other vias: 55.88,25.4
N$112  (via drill 1.1 pad 1.93)
  other vias: 33.02,22.86
N$113  (via drill 1.1 pad 1.93)
  other vias: 33.02,20.32
N$114  (via drill 1.1 pad 1.93)
  other vias: 33.02,17.78
N$115  (via drill 1.1 pad 1.93)
  other vias: 33.02,15.24
N$117  (via drill 1.1 pad 1.93)
  other vias: 53.34,30.48
N$119  (via drill 1.1 pad 1.93)
  other vias: 30.48,30.48
N$120  (via drill 1.1 pad 1.93)
  other vias: 30.48,27.94
N$121  (via drill 1.1 pad 1.93)
  other vias: 30.48,25.4
N$122  (via drill 1.1 pad 1.93)
  other vias: 30.48,22.86
N$123  (via drill 1.1 pad 1.93)
  other vias: 30.48,20.32
N$124  (via drill 1.1 pad 1.93)
  other vias: 30.48,17.78
N$125  (via drill 1.1 pad 1.93)
  other vias: 30.48,15.24
N$129  (via drill 1.1 pad 1.93)
  other vias: 27.94,15.24
N$130  (via drill 1.1 pad 1.93)
  other vias: 27.94,17.78
N$131  (via drill 1.1 pad 1.93)
  other vias: 27.94,20.32
N$132  (via drill 1.1 pad 1.93)
  other vias: 27.94,22.86
N$133  (via drill 1.1 pad 1.93)
  other vias: 58.42,25.4
N$134  (via drill 1.1 pad 1.93)
  other vias: 58.42,22.86
N$135  (via drill 1.1 pad 1.93)
  other vias: 55.88,22.86
N$136  (via drill 1.1 pad 1.93)
  other vias: 55.88,20.32
N$137  (via drill 1.1 pad 1.93)
  other vias: 58.42,20.32
N$148  (via drill 1.1 pad 1.93)
  other vias: 27.94,25.4
N$149  (via drill 1.1 pad 1.93)
  other vias: 55.88,17.78
N$150
  Top 0.305: LED5.A 1.91,12.67 R10.1
N$153  (via drill 1.1 pad 1.93)
  other vias: 27.94,30.48
N$155  (via drill 1.1 pad 1.93)
  other vias: 27.94,27.94
N$156  (via drill 1.1 pad 1.93)
  other vias: 35.56,27.94
N$158  (via drill 1.1 pad 1.93)
  other vias: 58.42,17.78
N$161  (via drill 1.1 pad 1.93)
  other vias: 58.42,15.24
N$162  (via drill 1.1 pad 1.93)
  other vias: 55.88,15.24
N$174  (via drill 1.1 pad 1.93)
  other vias: 55.88,30.48
NC
  Bottom 0.406: M1.RESERVED JP1.1
RESET  (via drill 0.5)
  Top 0.254: RESET.A 5.08,47.66 | 5.08,47.66 RESET.A' | v5.33,48.13 5.33,48.16 5.08,47.91 5.08,47.66
  Bottom 0.254: M1.RESET 33.02,1.65 32.64,1.27 | v5.33,48.13 2.67,48.13 1.14,46.61 1.14,6.6 2.41,5.33 14.73,5.33 18.8,1.27 32.64,1.27 | 32.64,1.27 64.14,1.27 64.9,2.03 64.9,3.43 64.26,4.06 64.26,5.71 63.63,6.35 M1.RESET_ICSP
  Bottom 0.406: M1.RESET JP1.3
RX
  Top 0.305: U1.P$10 22.62,29.1 24.77,31.24 24.77,33.02 24.26,33.53 22.73,33.53 22.48,33.78 22.48,38.23 22.61,38.35 U4.12
RX_5V
  Top 0.305: U4.11 24.89,37.08 25.65,37.85 56.77,37.85 57.15,38.23 57.15,40.26 58.29,41.4 58.29,44.58 SW2.P2
SCK  (via drill 0.5)
  Top 0.305: 21.84,40.13 21.84,35.81 v21.59,35.56 21.59,35.43 21.84,35.18 21.84,32.32 R9.2 | 21.84,40.13 21.08,40.89 U4.3 | v22.1,42.42 21.84,42.16 21.84,40.13
  Bottom 0.305: M1.SCK 62.74,27.94 61.72,28.96 61.72,35.81 60.07,37.47 23.5,37.47 v21.59,35.56 | SJ1.1 22.61,42.93 v22.1,42.42
SCL
  Bottom 0.406: M1.SCL U$9.1
SD_CD  (via drill 0.39)
  Top 0.203: X1.CD2 15.56,38.1 v14.35,38.1 | X1.CD1 15.78,43.94 v14.48,43.94
  Top 0.305: X1.CD1 17.05,45.21 36.45,45.21 JP6.5
  Bottom 0.203: v14.35,38.1 14.35,43.81 v14.48,43.94
SD_CS  (via drill 0.5)
  Top 0.305: R5.2 17.02,32.58 v17.02,35.05 17.78,35.81 U4.7 | U$9.8 36.58,46.86 39.37,44.07 40.13,44.07 JP6.4 41.78,41.15 40.26,39.62 v30.35,39.62
  Bottom 0.305: v17.02,35.05 17.02,36.96 19.81,39.75 19.94,39.62 v30.35,39.62
  Bottom 0.406: M1.D10 U$9.8
SD_CSIN
  Top 0.305: X1.2 12.73,38.07 14.22,36.58 17.53,36.58 18.03,37.08 U4.6
SD_DATAIN
  Top 0.305: X1.3 14.03,39.17 14.48,39.62 U4.4
SD_SCKIN
  Top 0.305: U4.2 7.75,42.16 6.99,41.4 5.64,41.4 X1.5
SDA
  Bottom 0.406: M1.SDA U$9.2
TX
  Top 0.305: U1.P$9 22.9,27.6 25.91,30.61 25.91,35.94 27.05,37.08 57.53,37.08 58.42,37.97 SW2.P1
VBACKUP  (via drill 0.5)
  Top 0.305: D1.C 19.56,12.19 v18.54,12.19
  Top 0.406: U1.P$4 21.25,20.1 20.57,19.43 v20.32,19.43
  Bottom 0.406: v20.32,19.43 20.32,14.35 18.54,12.57 v18.54,12.19
VIN
  Bottom 0.406: M1.VIN JP1.8

### Text on the board
Pinguin_tBackup: RESET | CS | TX | RX | 3V | CD | CCS | PPS | TX | RX | Soft. | Serial | Direct | GND | 3.3V | ICSP | FIX | L13 | Adafruit / Ultimate / GPS + / Logging / Shield | PWR | GND | 5.0V
Pinguin_bBackup: SCK | MISO | MOSI